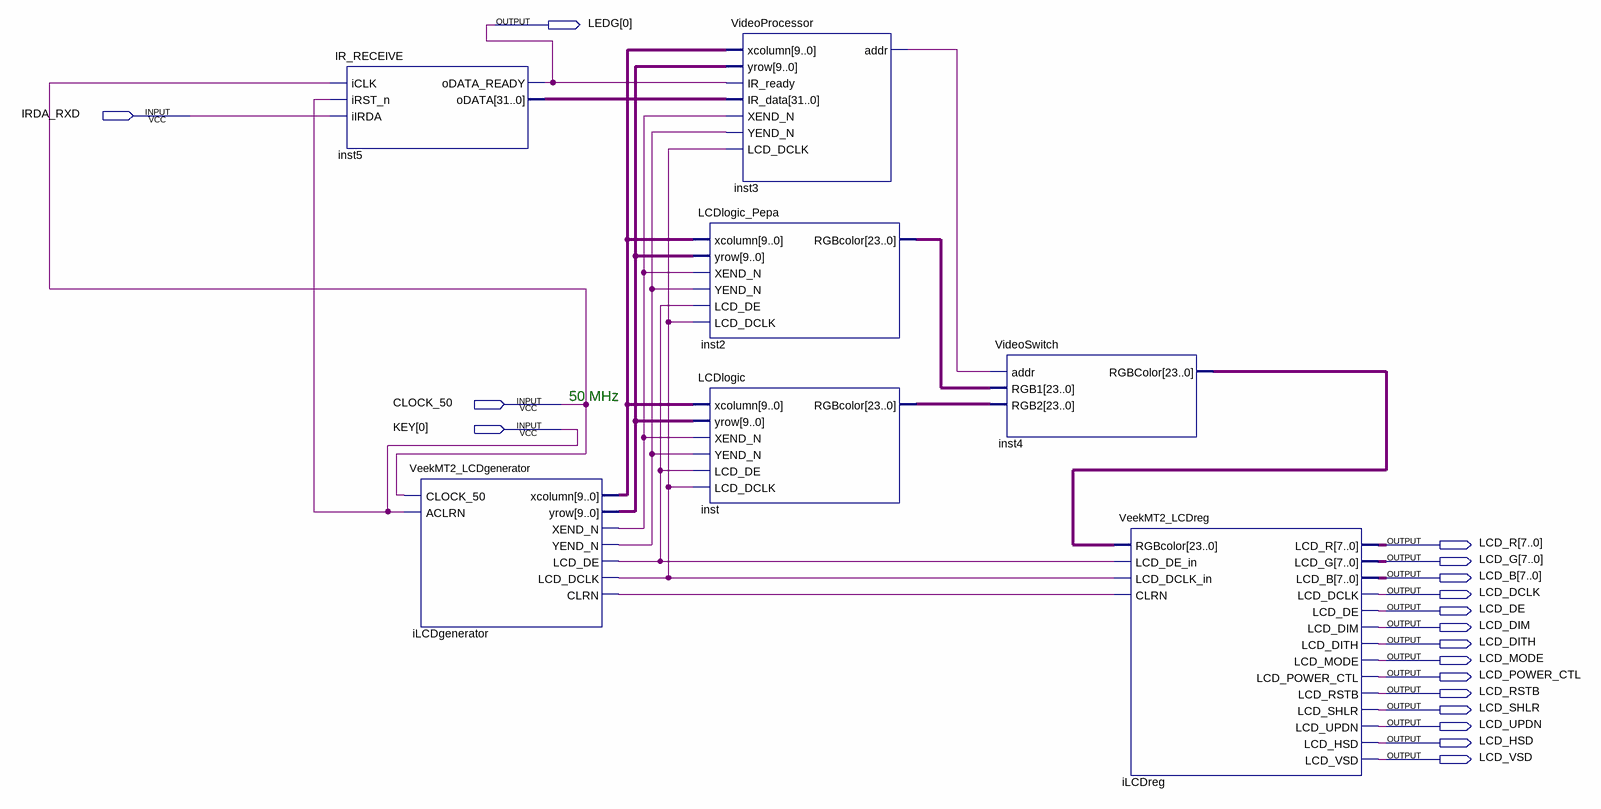
[diagram p0: schematic sheet]
// Quartus schematic Demo_LCD.bdf as structural Verilog: 7 symbols, 18 pins
module Demo_LCD (
  input  IRDA_RXD,
  input  CLOCK_50,
  input  [0:0] KEY,
  output [0:0] LEDG,
  output [7:0] LCD_R,
  output [7:0] LCD_G,
  output [7:0] LCD_B,
  output LCD_DCLK,
  output LCD_DE,
  output LCD_DIM,
  output LCD_DITH,
  output LCD_MODE,
  output LCD_POWER_CTL,
  output LCD_RSTB,
  output LCD_SHLR,
  output LCD_UPDN,
  output LCD_HSD,
  output LCD_VSD
);

  wire iLCDgenerator_clrn, iLCDgenerator_lcd_dclk, iLCDgenerator_lcd_de, iLCDgenerator_xend_n,
       iLCDgenerator_yend_n, inst3_addr;
  wire [9:0] iLCDgenerator_xcolumn, iLCDgenerator_yrow;
  wire [23:0] inst2_rgbcolor, inst4_rgbcolor, inst_rgbcolor;
  wire [31:0] inst5_odata;

  IR_RECEIVE inst5 (.iCLK(CLOCK_50), .iRST_n(KEY[0]), .iIRDA(IRDA_RXD), .oDATA_READY(LEDG[0]), .oDATA(inst5_odata));
  VeekMT2_LCDgenerator iLCDgenerator (
    .CLOCK_50(CLOCK_50), .ACLRN(KEY[0]), .xcolumn(iLCDgenerator_xcolumn), .yrow(iLCDgenerator_yrow),
    .XEND_N(iLCDgenerator_xend_n), .YEND_N(iLCDgenerator_yend_n), .LCD_DE(iLCDgenerator_lcd_de),
    .LCD_DCLK(iLCDgenerator_lcd_dclk), .CLRN(iLCDgenerator_clrn));
  VideoProcessor inst3 (
    .xcolumn(iLCDgenerator_xcolumn), .yrow(iLCDgenerator_yrow), .IR_ready(LEDG[0]), .IR_data(inst5_odata),
    .XEND_N(iLCDgenerator_xend_n), .YEND_N(iLCDgenerator_yend_n), .LCD_DCLK(iLCDgenerator_lcd_dclk),
    .addr(inst3_addr));
  LCDlogic_Pepa inst2 (
    .xcolumn(iLCDgenerator_xcolumn), .yrow(iLCDgenerator_yrow), .XEND_N(iLCDgenerator_xend_n),
    .YEND_N(iLCDgenerator_yend_n), .LCD_DE(iLCDgenerator_lcd_de), .LCD_DCLK(iLCDgenerator_lcd_dclk),
    .RGBcolor(inst2_rgbcolor));
  LCDlogic inst (
    .xcolumn(iLCDgenerator_xcolumn), .yrow(iLCDgenerator_yrow), .XEND_N(iLCDgenerator_xend_n),
    .YEND_N(iLCDgenerator_yend_n), .LCD_DE(iLCDgenerator_lcd_de), .LCD_DCLK(iLCDgenerator_lcd_dclk),
    .RGBcolor(inst_rgbcolor));
  VideoSwitch inst4 (.addr(inst3_addr), .RGB1(inst2_rgbcolor), .RGB2(inst_rgbcolor), .RGBColor(inst4_rgbcolor));
  VeekMT2_LCDreg iLCDreg (
    .RGBcolor(inst4_rgbcolor), .LCD_DE_in(iLCDgenerator_lcd_de), .LCD_DCLK_in(iLCDgenerator_lcd_dclk),
    .CLRN(iLCDgenerator_clrn), .LCD_R(LCD_R), .LCD_G(LCD_G), .LCD_B(LCD_B), .LCD_DCLK(LCD_DCLK),
    .LCD_DE(LCD_DE), .LCD_DIM(LCD_DIM), .LCD_DITH(LCD_DITH), .LCD_MODE(LCD_MODE),
    .LCD_POWER_CTL(LCD_POWER_CTL), .LCD_RSTB(LCD_RSTB), .LCD_SHLR(LCD_SHLR), .LCD_UPDN(LCD_UPDN),
    .LCD_HSD(LCD_HSD), .LCD_VSD(LCD_VSD));

  // Notes on the sheet:
  //   50 MHz
endmodule
